# Altium schematic sheet Power.SchDoc
size A
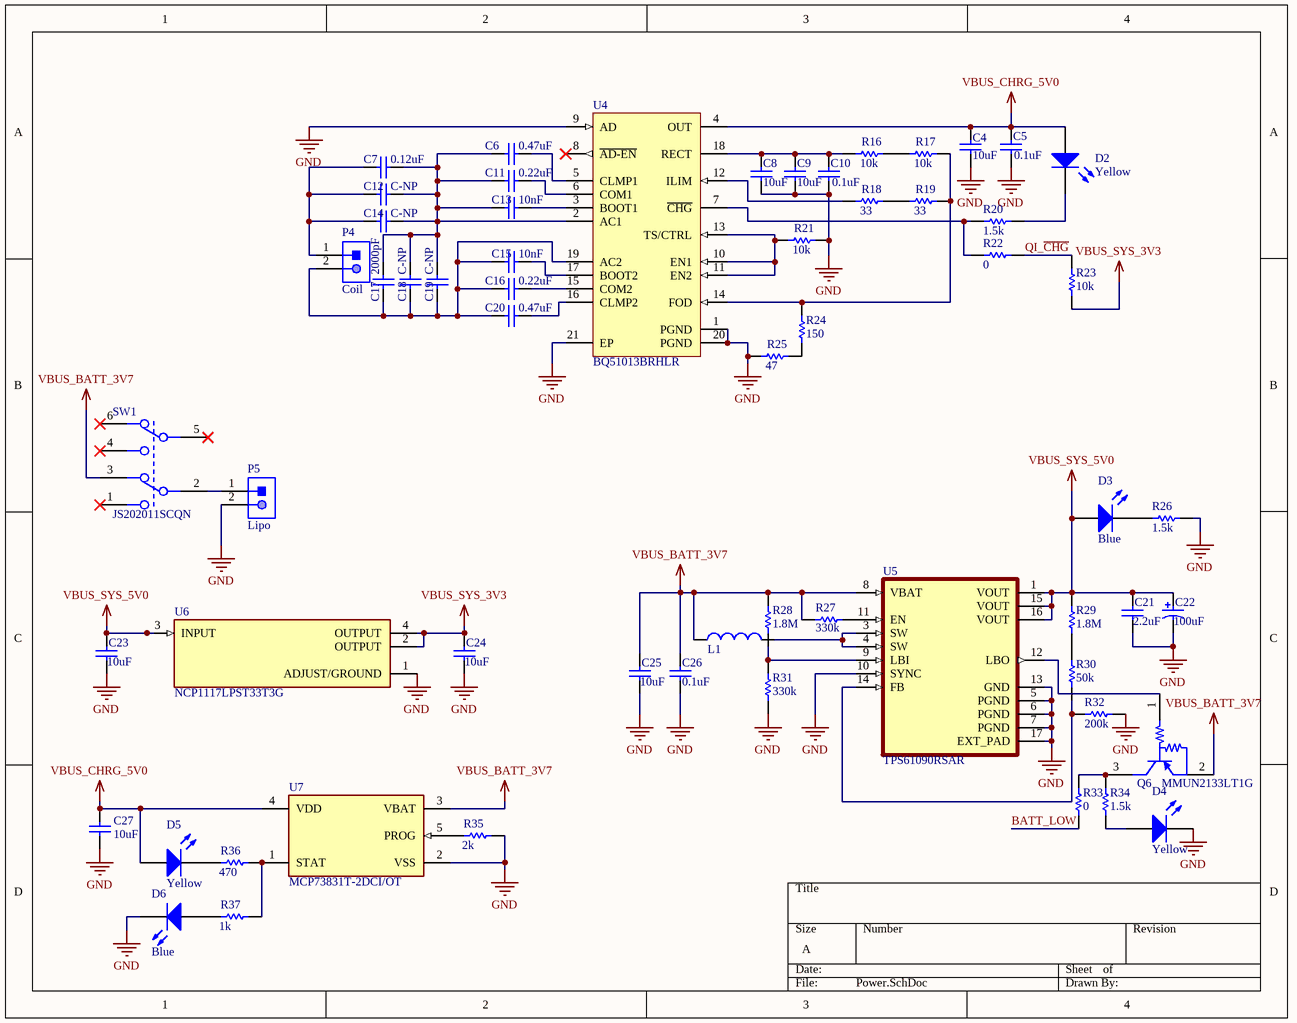
[diagram p0: Power.SchDoc]

## Parts
C4  10uF  [0603]
C5  0.1uF  [0603]
C6  0.47uF  [0603]
C7  0.12uF  [0603]
C8  10uF  [0603]
C9  10uF  [0603]
C10  0.1uF  [0603]
C11  0.22uF  [0603]
C12  C-NP  [0603]
C13  10nF  [0603]
C14  C-NP  [0603]
C15  10nF  [0603]
C16  0.22uF  [0603]
C17  2000pF  [0603]
C18  C-NP  [0603]
C19  C-NP  [0603]
C20  0.47uF  [0603]
C21  2.2uF  [0805]
C22  100uF  [PNSC-FP-V-C_V]
C23  10uF  [0805]
C24  10uF  [0805]
C25  10uF  [0805]
C26  0.1uF  [0805]
C27  10uF  [0805]
D2  Yellow  [1206_A_LED]
D3  Blue  [1206_A_LED]
D4  Yellow  [1206_A_LED]
D5  Yellow  [1206_A_LED]
D6  Blue  [1206_A_LED]
L1  MSS6132-472MLB  [COILCRAFT MSS6132 SERIES]  (value not drawn)
P4  Coil  [JST-S2B-PH-K-S_V]
P5  Lipo  [JST-S2B-PH-K-S_V]
Q6  MMUN2133LT1G  [ONSC-SOT-23-3-318-08_V]
R16  10k  [0603_RES_HD]
R17  10k  [0603_RES_HD]
R18  33  [0603_RES_HD]
R19  33  [0603_RES_HD]
R20  1.5k  [0603_RES_HD]
R21  10k  [0603_RES_HD]
R22  0  [0603_RES_HD]
R23  10k  [0603_RES_HD]
R24  150  [0603_RES_HD]
R25  47  [0603_RES_HD]
R26  1.5k  [0805_RES_HD]
R27  330k  [0805_RES_HD]
R28  1.8M  [0805_RES_HD]
R29  1.8M  [0805_RES_HD]
R30  50k  [0805_RES_HD]
R31  330k  [0805_RES_HD]
R32  200k  [0805_RES_HD]
R33  0  [0805_RES_HD]
R34  1.5k  [0805_RES_HD]
R35  2k  [0805_RES_HD]
R36  470  [0805_RES_HD]
R37  1k  [0805_RES_HD]
SW1  JS202011SCQN  [FP-JS202011SCQN-MFG]
U4  BQ51013BRHLR  [RHL0020A_V]
U5  TPS61090RSAR  [QFN65P400X400X100-17N]
U6  NCP1117LPST33T3G  [FP-318H-MFG]
U7  MCP73831T-2DCI/OT  [FP-C04-091-OT-IPC_B]

## Nets
GND: C4.1 C5.1 C8.1 C9.1 C10.1 C21.2 C22.2 C23.2 C24.2 C25.2 C26.2 C27.2 D4.1(K) D6.1(K) P5.2 R21.2 R25.1 R26.1 R31.1 R32.2 R35.2 U4.1(PGND) U4.9(AD) U4.20(PGND) U4.21(EP) U5.5(PGND) U5.6(PGND) U5.7(PGND) U5.10(SYNC) U5.13(GND) U5.17(EXT_PAD) U6.1(ADJUST/GROUND) U7.2(VSS)
VBUS_BATT_3V7: C25.1 C26.1 L1.1 Q6.2(E) R27.1 R28.2 SW1.3 U5.8(VBAT) U7.3(VBAT)
VBUS_CHRG_5V0: C4.2 C5.2 C27.1 D2.2(A) D5.2(A) U4.4(OUT) U7.4(VDD)
VBUS_SYS_3V3: C24.1 R23.1 U6.2(OUTPUT) U6.4(OUTPUT)
VBUS_SYS_5V0: C21.1 C22.1 C23.1 D3.2(A) R29.2 U5.1(VOUT) U5.15(VOUT) U5.16(VOUT) U6.3(INPUT)
BATT_LOW: R33.1
QI_~{CHG}: R22.1 R23.2
NetC6_1: C6.1 U4.5(CLMP1)
NetC6_2: C6.2 C7.1 C11.2 C12.1 C13.2 C14.1 C17.1 C18.1 C19.1 U4.2(AC1)
NetC7_2: C7.2 C12.2 C14.2 P4.1
NetC8_2: C8.2 C9.2 C10.2 R16.1 U4.18(RECT)
NetC11_1: C11.1 U4.6(COM1)
NetC13_1: C13.1 U4.3(BOOT1)
NetC15_1: C15.1 U4.17(BOOT2)
NetC15_2: C15.2 C16.2 C17.2 C18.2 C19.2 C20.2 P4.2 U4.19(AC2)
NetC16_1: C16.1 U4.15(COM2)
NetC20_1: C20.1 U4.16(CLMP2)
NetD2_1: D2.1(K) R20.1
NetD3_1: D3.1(K) R26.2
NetD4_2: D4.2(A) R34.1
NetD5_1: D5.1(K) R36.1
NetD6_2: D6.2(A) R37.1
NetL1_2: L1.2 U5.3(SW) U5.4(SW)
NetP5_1: P5.1 SW1.2
NetQ6_1: Q6.1(B) U5.12(LBO)
NetQ6_3: Q6.3(C) R33.2 R34.2
NetR16_2: R16.2 R17.1
NetR17_2: R17.2 R19.2 R24.2 U4.14(FOD)
NetR18_1: R18.1 U4.12(ILIM)
NetR18_2: R18.2 R19.1
NetR20_2: R20.2 R22.2 U4.7(~{CHG})
NetR21_1: R21.1 U4.10(EN1) U4.11(EN2) U4.13(TS/CTRL)
NetR24_1: R24.1 R25.2
NetR27_2: R27.2 U5.11(EN)
NetR28_1: R28.1 R31.2 U5.9(LBI)
NetR29_1: R29.1 R30.1
NetR30_2: R30.2 R32.1 U5.14(FB)
NetR35_1: R35.1 U7.5(PROG)
NetR36_2: R36.2 R37.2 U7.1(STAT)

Not connected (* = marked no-connect by the designer): SW1 1* 4* 5* 6*; U4 8(~{AD-EN})*

## Library data of the parts
C4 C8 C9 = C1608C0G1H361J: 10uF, 10%, 25V; Manufacturer 1: TDK; GFUPartNo: C1608C0G1H361J; Manufacturer Part Number 1: C1608C0G1H361J; Part Type: SMT; PackageReference: 0603; Supplier 1: Digi-Key; Supplier Part Number 1: 445-5067-1-ND
C5 C10 = C1608C0G1H361J: 0.1uF, 10%, 50V; Manufacturer 1: TDK; GFUPartNo: C1608C0G1H361J; Manufacturer Part Number 1: C1608C0G1H361J; Part Type: SMT; PackageReference: 0603; Supplier 1: Digi-Key; Supplier Part Number 1: 445-5067-1-ND
C6 C20 = C1608C0G1H361J: 0.47uF, 10%, 25V; Manufacturer 1: TDK; GFUPartNo: C1608C0G1H361J; Manufacturer Part Number 1: C1608C0G1H361J; Part Type: SMT; PackageReference: 0603; Supplier 1: Digi-Key; Supplier Part Number 1: 445-5067-1-ND
C7 C12 C14 = C1608C0G1H361J: 0.12 uF, 10%, 25V; Manufacturer 1: TDK; GFUPartNo: C1608C0G1H361J; Manufacturer Part Number 1: C1608C0G1H361J; Part Type: SMT; PackageReference: 0603; Supplier 1: Digi-Key; Supplier Part Number 1: 445-5067-1-ND
C11 C16 = C1608C0G1H361J: 0.22uF, 10%, 25V; Manufacturer 1: TDK; GFUPartNo: C1608C0G1H361J; Manufacturer Part Number 1: C1608C0G1H361J; Part Type: SMT; PackageReference: 0603; Supplier 1: Digi-Key; Supplier Part Number 1: 445-5067-1-ND
C13 C15 = C1608C0G1H361J: 10nF, 10%, 25V; Manufacturer 1: TDK; GFUPartNo: C1608C0G1H361J; Manufacturer Part Number 1: C1608C0G1H361J; Part Type: SMT; PackageReference: 0603; Supplier 1: Digi-Key; Supplier Part Number 1: 445-5067-1-ND
C17-C19 = C1608C0G1H361J: 2000 pF, 10%, 50V; Manufacturer 1: TDK; GFUPartNo: C1608C0G1H361J; Manufacturer Part Number 1: C1608C0G1H361J; Part Type: SMT; PackageReference: 0603; Supplier 1: Digi-Key; Supplier Part Number 1: 445-5067-1-ND
C21 C23-C27 = CC0805KRX7R9BB152: 1.5nF, 10%, 50V; Manufacturer 1: Yageo; GFUPartNo: CC0805KRX7R9BB152; Manufacturer Part Number 1: CC0805KRX7R9BB152; Part Type: SMT; PackageReference: 0805; Supplier 1: Digi-Key; Supplier Part Number 1: 311-1128-1-ND
C22 = CMP-2000-06213-1: EEE-HA Series 6.3 V 100 uF Ø 5 x 5.4 mm 105 °C SMT V-Chip Aluminum Electrolytic. EEE-HA0J101WR; Manufacturer: Panasonic; ESR (Equivalent Series Resistance): 0.36O; Ripple Current: 240mA; Capacitance: 22µF; Lifetime@Temperature: 2000Hrs@105°C; Rated Voltage: 25V; Type: Can; Package Reference: FP-V-C; Package Description: 2-Pin Electrolytic Aluminum Capacitor, Body 5.3 x 5.3 mm; Operating Temp Range: -55to+105°C; Mounting Technology: SurfaceMount; Datasheet URL: http://industrial.panasonic.com/cdbs/www-data/pdf/RDE0000/ABA0000C1184.pdf; Case Size/Dimension: Ø5x5.8mm; Operating Temp-Max: 105°C; Package URL: http://industrial.panasonic.com/cdbs/www-data/pdf/RDE0000/DME0000COL48.pdf; Datasheet Version: 03/2016; Series: FP; Manufacturer URL: http://www.panasonic.com/
D2-D6 = WE-LED_K1A2-2_Local
L1 = MSS6132-472MLB: INDUCTOR POWER 4.7UH SHIELDED SMD; Manufacturer 1: Coilcraft; Current: 2.3A; Tolerance: 20%; Shielded: YES; GFUPartNo: MSS6132-472MLB; Manufacturer Part Number 1: MSS6132-472MLB; Inductance: 4.7uH; Part Type: SMT; Supplier 1: Coilcraft; Supplier Part Number 1: MSS6132-472MLB; Supplier Unit Price 1: 0.94; Supplier Order Qty 1: 1; Supplier 2: Coilcraft; Supplier Part Number 2: MSS6132-472MLB; Supplier Unit Price 2: 0.94; Supplier Order Qty 2: 100
P4 P5 = CMP-1755-00004-1: Male Header, Pitch 2 mm, 1 x 2 Position, Height 4.8 mm, Tail Length 3.4 mm, -25 to 85 degC, RoHS, Bulk; Case\Package: Radial; Tolerance: 20%; Capacitance: 10 uF; Voltage Rating (DC): 50 V; Packaging: Bulk; ComponentLink1URL: http://www.jst-mfg.com/product/pdf/eng/ePH.pdf; Radiation Hardening: No; Height: 11 mm; Package Quantity: 200; PackageDescription: Male Header, Pitch 2 mm, 1 x 2 Position, Height 4.8 mm, Tail Length 3.4 mm; PackageReference: S2B-PH-K-S; Diameter: 5 mm; Pins: 2; Mount: Through Hole; Max Operating Temperature: 85 degC; Min Operating Temperature: -40 degC; ComponentLink1Description: Datasheet; DatasheetVersion: Dec-12; Length: 11 mm; Lead Pitch: 2 mm; REACH SVHC: No SVHC; Voltage Rating: 50 V; RoHSCompliant: true
Q6 = CMP-0630-00284-1: Digital Transistor (BRT), R1=4.7 kOhm, R2=47 kOhm, PNP Transistor, 3-Pin SOT-23, Pb-Free, Tape and Reel; Manufacturer: On Semiconductor; V(BR)CEO Min (V): 50; R1/R2 Typ: 0.1; hFE Min: 80; RoHS: TRUE; PartNumber: MMUN2133LT1G; ComponentLink3URL: http://www.onsemi.cn/pub_link/Collateral/318-08.PDF; Polarity: PNP; PackageReference: SOT-23-3-318-08; ComponentLink3Description: Package Specification; Packing: Tape and Reel; PackageVersion: Rev. AP, 11/2009; PackageDescription: 3-Pin Small Outline Transistor, Body 2.92 x 1.3 mm, Pitch 0.95 mm; ComponentLink1Description: Manufacturer URL; ComponentLink2Description: Datasheet; IC Continuous (A): 0.1; ComponentLink1URL: http://www.onsemi.com/; DatasheetVersion: Rev. 6; ComponentLink2URL: http://www.onsemi.cn/pub_link/Collateral/DTA143Z-D.PDF; Mounting Technology: Surface Mount
R16 R17 R21 = RC0603JR-0718RL: RES 10k OHM 1/10W 5% 0603 SMD; Manufacturer 1: Yageo; GFUPartNo: RC0603JR-0718RL; Manufacturer Part Number 1: RC0603JR-0718RL; Part Type: SMT; Supplier 1: Digi-Key; Supplier Part Number 1: 311-18GRCT-ND
R18 R19 = RC0603JR-0718RL: RES 33 OHM 1/10W 5% 0603 SMD; Manufacturer 1: Yageo; GFUPartNo: RC0603JR-0718RL; Manufacturer Part Number 1: RC0603JR-0718RL; Part Type: SMT; Supplier 1: Digi-Key; Supplier Part Number 1: 311-18GRCT-ND
R20 R22 R23 = RC0603JR-0718RL: RES 1.5k OHM 1/10W 5% 0603 SMD; Manufacturer 1: Yageo; GFUPartNo: RC0603JR-0718RL; Manufacturer Part Number 1: RC0603JR-0718RL; Part Type: SMT; Supplier 1: Digi-Key; Supplier Part Number 1: 311-18GRCT-ND
R24 = RC0603JR-0718RL: RES 150 OHM 1/10W 5% 0603 SMD; Manufacturer 1: Yageo; GFUPartNo: RC0603JR-0718RL; Manufacturer Part Number 1: RC0603JR-0718RL; Part Type: SMT; Supplier 1: Digi-Key; Supplier Part Number 1: 311-18GRCT-ND
R25 = RC0603JR-0718RL: RES 47 OHM 1/10W 5% 0603 SMD; Manufacturer 1: Yageo; GFUPartNo: RC0603JR-0718RL; Manufacturer Part Number 1: RC0603JR-0718RL; Part Type: SMT; Supplier 1: Digi-Key; Supplier Part Number 1: 311-18GRCT-ND
R26 R33 R34 = RC0805FR-07100RL: 1.5kOhm ±1% 0.125W, 1/8W Surface Mount Resistor Thick Film ±100ppm/°C 0805; Manufacturer 1: Yageo; GFUPartNo: RC0805FR-07100RL; Manufacturer Part Number 1: RC0805FR-07100RL; Part Type: SMT; Supplier 1: Digi-Key; Supplier Part Number 1: 311-100CRCT-ND
R27 R31 = RC0805FR-07100RL: 330kOhm ±1% 0.125W, 1/8W Surface Mount Resistor Thick Film ±100ppm/°C 0805; Manufacturer 1: Yageo; GFUPartNo: RC0805FR-07100RL; Manufacturer Part Number 1: RC0805FR-07100RL; Part Type: SMT; Supplier 1: Digi-Key; Supplier Part Number 1: 311-100CRCT-ND
R28 = RC0805FR-07100RL: 1.8MOhm ±1% 0.125W, 1/8W Surface Mount Resistor Thick Film ±100ppm/°C 0805; Manufacturer 1: Yageo; GFUPartNo: RC0805FR-07100RL; Manufacturer Part Number 1: RC0805FR-07100RL; Part Type: SMT; Supplier 1: Digi-Key; Supplier Part Number 1: 311-100CRCT-ND
R29 = RC0805FR-07100RL: 100 Ohm ±1% 0.125W, 1/8W Surface Mount Resistor Thick Film ±100ppm/°C 0805; Manufacturer 1: Yageo; GFUPartNo: RC0805FR-07100RL; Manufacturer Part Number 1: RC0805FR-07100RL; Part Type: SMT; Supplier 1: Digi-Key; Supplier Part Number 1: 311-100CRCT-ND
R30 R32 = RC0805FR-07100RL: 50k Ohm ±1% 0.125W, 1/8W Surface Mount Resistor Thick Film ±100ppm/°C 0805; Manufacturer 1: Yageo; GFUPartNo: RC0805FR-07100RL; Manufacturer Part Number 1: RC0805FR-07100RL; Part Type: SMT; Supplier 1: Digi-Key; Supplier Part Number 1: 311-100CRCT-ND
R35 = RC0805FR-07100RL: 20kOhm ±1% 0.125W, 1/8W Surface Mount Resistor Thick Film ±100ppm/°C 0805; Manufacturer 1: Yageo; GFUPartNo: RC0805FR-07100RL; Manufacturer Part Number 1: RC0805FR-07100RL; Part Type: SMT; Supplier 1: Digi-Key; Supplier Part Number 1: 311-100CRCT-ND
R36 R37 = RC0805FR-07100RL: 470Ohm ±1% 0.125W, 1/8W Surface Mount Resistor Thick Film ±100ppm/°C 0805; Manufacturer 1: Yageo; GFUPartNo: RC0805FR-07100RL; Manufacturer Part Number 1: RC0805FR-07100RL; Part Type: SMT; Supplier 1: Digi-Key; Supplier Part Number 1: 311-100CRCT-ND
SW1 = CMP-2000-05087-2: SWITCH SLIDE DPDT 300MA 6V; Actuator Material: Nylon; Actuator Length: 2mm; Actuator Type: Standard; Contact Resistance: 70mR; Switch Function: On-On; Electrical Life: 5000Cycles; Voltage Rating (DC): 6V; Contact Current Rating: 300mA; Contact Plating: Silver; Throw Configuration: DPDT; REACH SVHC: No SVHC; Length: 9mm; Package Quantity: 1; Min Operating Temperature: -20°C; Contact Material: Copper Alloy; Switch Travel: 2mm; Radiation Hardening: No; Depth: 7.5mm; Packaging: Tape and Reel; Max Voltage Rating (DC): 6V; Housing Material: Nylon; Max Operating Temperature: 85°C; Current Rating: 300mA; Orientation: Vertical; Termination: Gull Wing; Flammability Rating: UL94 V-2; Lead Free: Lead Free; Mount: Surface Mount; Max Current Rating: 300mA
U4 = CMP-0393-00005-2: WPC 1.1 Compatible Fully Integrated Wireless Power Receiver IC, 4 V Min Input, 20-pin VQFN (RHL), Green (RoHS & no Sb/Br); Vin(Min)(V): 4; Eco-Plan: TRUE; ComponentLink1Description: Manufacturer URL; PackageDescription: 20-Pin Plastic Flat Pack, Body 4.5 x 3.5 mm, Pitch 0.5 mm; Mounting Technology: Surface Mount; ComponentLink3Description: Package Specification; PartNumber: BQ51013B; PackageVersion: 4205346-3/J, 12/2011; ComponentLink1URL: http://www.ti.com/; PackageReference: RHL0020A; ComponentLink3URL: http://www.ti.com/lit/ds/symlink/bq51051b.pdf; ComponentLink2Description: Datasheet; ComponentLink2URL: http://www.ti.com/lit/ds/symlink/bq51013b.pdf; DatasheetVersion: SLUSB62
U5 = TPS61090RSAR: 1.8Vin, 2A Switch, 96% Efficient Boost Converter 16-QFN -40 to 85; MF: Texas Instruments; SnapEDA_Link: https://www.snapeda.com/parts/TPS61090RSAR/Texas%20Instruments/view-part/51689/?ref=snap; Availability: Good; Price: None; Package: VQFN-16 Texas Instruments; Purchase-URL: https://pricing.snapeda.com/search/part/TPS61090RSAR/?ref=eda; Check_prices: https://www.snapeda.com/parts/TPS61090RSAR/Texas%20Instruments/view-part/51689/?ref=eda; Value: *; MP: TPS61090RSAR
U6 = CMP-07128-000031-1: IC REG LINEAR 3.3V 1A SOT223; Output Type: Fixed; Dropout Voltage: 1.3V; Min Input Voltage: -300mV; Power Supply Rejection Ratio (PSRR): 60dB; Number of Outputs: 1; Reference Voltage: 1.275V; Quiescent Current: 700uA; Max Input Voltage: 18V; Polarity: Positive; Min Current Limit: 1.1A; Height: 1.69mm; Mount: Surface Mount; Min Output Voltage: 3.3V; Case/Package: SOT-223; Length: 6.7mm; Nominal Output Voltage: 3.3V; Output Current: 1A; Number of Regulators: 1; Max Operating Temperature: 125°C; Packaging: Tape and Reel; Number of Pins: 3; Min Operating Temperature: 0°C; Halogen Free: Halogen Free; Contact Plating: Tin; Width: 3.7mm; REACH SVHC: No SVHC; Package Quantity: 1; Output Voltage: 3.3V; Lead Free: Lead Free; Max Output Current: 1A
U7 = CMP-0133-00146-2: IC CONTROLLR LI-ION 4.2V SOT23-5; Max Charge Current: 500mA; Min Output Voltage: 4.168V; Max Supply Voltage: 6V; Max Output Voltage: 4.232V; Number of Cells: 1; Operating Supply Current: 510uA; Min Supply Voltage: 3.75V; Max Output Current: 500mA; Case/Package: SOT-23; Radiation Hardening: No; REACH SVHC: No SVHC; Package Quantity: 3000; Output Current: 500mA; Number of Channels: 1; Output Voltage: 4.2V; Max Operating Temperature: 85°C; Number of Pins: 5; Mount: Surface Mount; Length: 3.1mm; Contact Plating: Tin; Packaging: Tape and Reel; Width: 1.8mm; Min Operating Temperature: -40°C; Max Input Voltage: 3.75V; Height: 1.3mm; Lead Free: Lead Free